# Altium schematic sheet MCU_CONTROL.SchDoc: MCU CONTROL
size 420 x 297 mm; DocumentNumber: 3; SheetNumber: 3; SheetTotal: 8
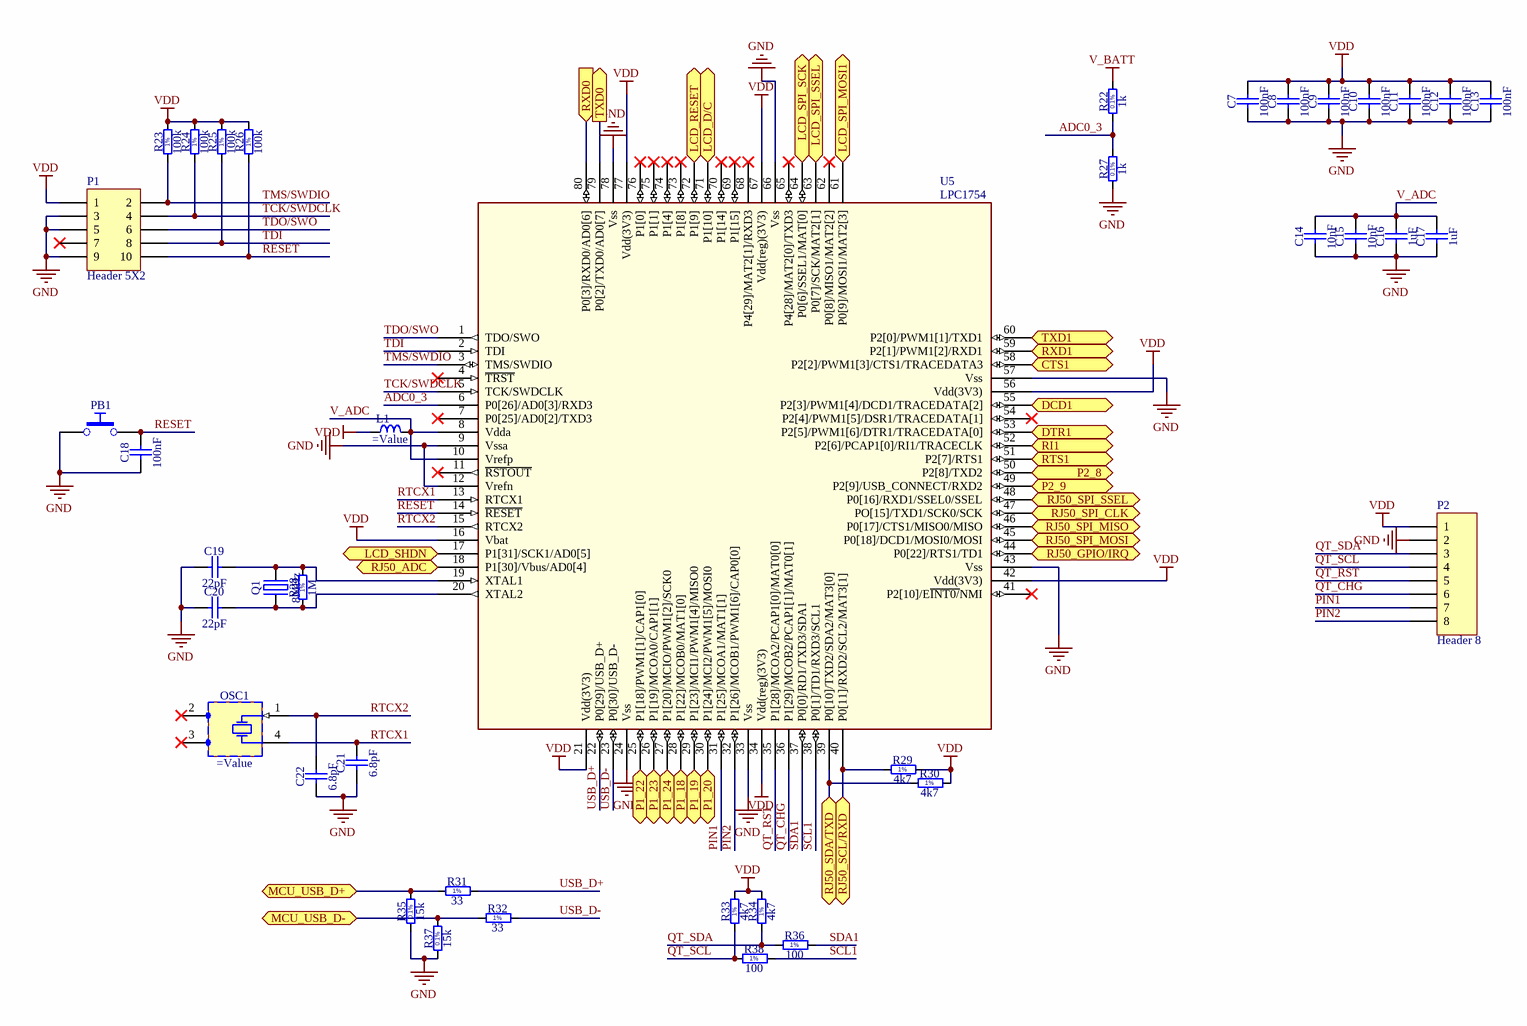
[diagram p0: MCU_CONTROL.SchDoc]

## Parts
C7  100nF  [CAPC1608X87N]
C8  100nF  [CAPC1608X87N]
C9  100nF  [CAPC1608X87N]
C10  100nF  [CAPC1608X87N]
C11  100nF  [CAPC1608X87N]
C12  100nF  [CAPC1608X87N]
C13  100nF  [CAPC1608X87N]
C14  10nF  [CAPC1608X87N]
C15  10nF  [CAPC1608X87N]
C16  1uF  [CAPC1608X87N]
C17  1uF  [CAPC1608X87N]
C18  100nF  [CAPC1608X87N]
C19  22pF  [CAPC1608X87N]
C20  22pF  [CAPC1608X87N]
C21  6.8pF  [CAPC1608X87N]
C22  6.8pF  [CAPC1608X87N]
L1  (no value)  [INDC1608X95N]
OSC1  (no value)  [85SMX CRYSTALS]
P1  Header 5X2  [HDR2X5]
P2  Header 8  [Pin_Head 2x4]
PB1  (no value)  [PB_TYCO_ALCOSWITCH_FSMSM]
Q1  8MHz  [XTAL_SMD]
R22  1k  [RESC1608X55N]
R23  100k  [RESC1608X55N]
R24  100k  [RESC1608X55N]
R25  100k  [RESC1608X55N]
R26  100k  [RESC1608X55N]
R27  1k  [RESC1608X55N]
R28  1M  [RESC1608X55N]
R29  4k7  [RESC1608X55N]
R30  4k7  [RESC1608X55N]
R31  33  [RESC1608X55N]
R32  33  [RESC1608X55N]
R33  4k7  [RESC1608X55N]
R34  4k7  [RESC1608X55N]
R35  15k  [RESC1608X55N]
R36  100  [RESC1608X55N]
R37  15k  [RESC1608X55N]
R38  100  [RESC1608X55N]
U5  LPC1754  [LQFP80]

## Ports
CTS1 (in), DCD1 (in), DTR1 (out), LCD_D/C (out), LCD_RESET (out), LCD_SHDN (out), LCD_SPI_MOSI1 (out), LCD_SPI_SCK (out), LCD_SPI_SSEL (out), MCU_USB_D+ (bidir), MCU_USB_D- (bidir), P1_18 (in), P1_19 (out), P1_20 (out), P1_22 (out), P1_23 (out), P1_24 (out), P2_8 (out), P2_9 (in), RI1 (in), RJ50_ADC (in), RJ50_GPIO/IRQ (bidir), RJ50_SCL/RXD (bidir), RJ50_SDA/TXD (bidir), RJ50_SPI_CLK (bidir), RJ50_SPI_MISO (bidir), RJ50_SPI_MOSI (bidir), RJ50_SPI_SSEL (bidir), RTS1 (out), RXD0 (in), RXD1 (in), TXD0 (out), TXD1 (out)

## Nets
GND: C7.1 C8.1 C9.1 C10.1 C11.1 C12.1 C13.1 C14.1 C15.1 C16.1 C17.1 C18.1 C19.1 C20.1 C21.1 C22.1 P1.3 P1.5 P1.9 P2.2 PB1.1 R27.1 R35.1 R37.1 U5.9(Vssa) U5.12(Vrefn) U5.24(Vss) U5.33(Vss) U5.43(Vss) U5.57(Vss) U5.66(Vss) U5.78(Vss)
V_BATT: R22.2
VDD: C7.2 C8.2 C9.2 C10.2 C11.2 C12.2 C13.2 L1.1 P1.1 P2.1 R23.2 R24.2 R25.2 R26.2 R29.2 R30.2 R33.2 R34.2 U5.16(Vbat) U5.21(Vdd(3V3)) U5.34(Vdd(reg)(3V3)) U5.42(Vdd(3V3)) U5.56(Vdd(3V3)) U5.67(Vdd(reg)(3V3)) U5.77(Vdd(3V3))
ADC0_3: R22.1 R27.2 U5.6(P0[26]/AD0[3]/RXD3)
CTS1: U5.58(P2[2]/PWM1[3]/CTS1/TRACEDATA3) ; port CTS1
DCD1: U5.55(P2[3]/PWM1[4]/DCD1/TRACEDATA[2]) ; port DCD1
DTR1: U5.53(P2[5]/PWM1[6]/DTR1/TRACEDATA[0]) ; port DTR1
LCD_D/C: U5.71(P1[10]) ; port LCD_D/C
LCD_RESET: U5.72(P1[9]) ; port LCD_RESET
LCD_SHDN: U5.17(P1[31]/SCK1/AD0[5]) ; port LCD_SHDN
LCD_SPI_MOSI1: U5.61(P0[9]/MOSI1/MAT2[3]) ; port LCD_SPI_MOSI1
LCD_SPI_SCK: U5.64(P0[6]/SSEL1/MAT[0]) ; port LCD_SPI_SCK
LCD_SPI_SSEL: U5.63(P0[7]/SCK/MAT2[1]) ; port LCD_SPI_SSEL
MCU_USB_D+: R31.1 R35.2 ; port MCU_USB_D+
MCU_USB_D-: R32.1 R37.2 ; port MCU_USB_D-
P1_18: U5.28(P1[22]/MCOB0/MAT1[0]) ; port P1_18
P1_19: U5.29(P1[23]/MCI1/PWM1[4]/MISO0) ; port P1_19
P1_20: U5.30(P1[24]/MCI2/PWM1[5]/MOSI0) ; port P1_20
P1_22: U5.25(P1[18]/PWM1[1]/CAP1[0]) ; port P1_22
P1_23: U5.26(P1[19]/MCOA0/CAP1[1]) ; port P1_23
P1_24: U5.27(P1[20]/MCIO/PWM1[2]/SCK0) ; port P1_24
P2_8: U5.50(P2[8]/TXD2) ; port P2_8
P2_9: U5.49(P2[9]/USB_CONNECT/RXD2) ; port P2_9
PIN1: P2.7 U5.31(P1[25]/MCOA1/MAT1[1])
PIN2: P2.8 U5.32(P1[26]/MCOB1/PWM1[6]/CAP0[0])
QT_CHG: P2.6 U5.36(P1[29]/MCOB2/PCAP1[1]/MAT0[1])
QT_RST: P2.5 U5.35(P1[28]/MCOA2/PCAP1[0]/MAT0[0])
QT_SCL: P2.4 R33.1 R38.1
QT_SDA: P2.3 R34.1 R36.1
RESET: C18.2 P1.10 PB1.2 R26.1 U5.14(~{RESET})
RI1: U5.52(P2[6]/PCAP1[0]/RI1/TRACECLK) ; port RI1
RJ50_ADC: U5.18(P1[30]/Vbus/AD0[4]) ; port RJ50_ADC
RJ50_GPIO/IRQ: U5.44(P0[22]/RTS1/TD1) ; port RJ50_GPIO/IRQ
RJ50_SCL/RXD: R29.1 U5.40(P0[11]/RXD2/SCL2/MAT3[1]) ; port RJ50_SCL/RXD
RJ50_SDA/TXD: R30.1 U5.39(P0[10]/TXD2/SDA2/MAT3[0]) ; port RJ50_SDA/TXD
RJ50_SPI_CLK: U5.47(PO[15]/TXD1/SCK0/SCK) ; port RJ50_SPI_CLK
RJ50_SPI_MISO: U5.46(P0[17]/CTS1/MISO0/MISO) ; port RJ50_SPI_MISO
RJ50_SPI_MOSI: U5.45(P0[18]/DCD1/MOSI0/MOSI) ; port RJ50_SPI_MOSI
RJ50_SPI_SSEL: U5.48(P0[16]/RXD1/SSEL0/SSEL) ; port RJ50_SPI_SSEL
RTCX1: C21.2 OSC1.4(X) U5.13(RTCX1)
RTCX2: C22.2 OSC1.1(X) U5.15(RTCX2)
RTS1: U5.51(P2[7]/RTS1) ; port RTS1
RXD0: U5.80(P0[3]/RXD0/AD0[6]) ; port RXD0
RXD1: U5.59(P2[1]/PWM1[2]/RXD1) ; port RXD1
SCL1: R38.2 U5.38(P0[1]/TD1/RXD3/SCL1)
SDA1: R36.2 U5.37(P0[0]/RD1/TXD3/SDA1)
TCK/SWDCLK: P1.4 R24.1 U5.5(TCK/SWDCLK)
TDI: P1.8 R25.1 U5.2(TDI)
TDO/SWO: P1.6 U5.1(TDO/SWO)
TMS/SWDIO: P1.2 R23.1 U5.3(TMS/SWDIO)
TXD0: U5.79(P0[2]/TXD0/AD0[7]) ; port TXD0
TXD1: U5.60(P2[0]/PWM1[1]/TXD1) ; port TXD1
USB_D+: R31.2 U5.22(P0[29]/USB_D+)
USB_D-: R32.2 U5.23(P0[30]/USB_D-)
V_ADC: C14.2 C15.2 C16.2 C17.2 L1.2 U5.8(Vdda) U5.10(Vrefp)
NetC19_2: C19.2 Q1.2(OSC2) R28.2 U5.19(XTAL1)
NetC20_2: C20.2 Q1.1(OSC1) R28.1 U5.20(XTAL2)

Not connected (* = marked no-connect by the designer): OSC1 2(GND)* 3(GND)*; P1 7*; U5 4(~{TRST})* 7(P0[25]/AD0[2]/TXD3)* 11(~{RSTOUT})* 41(P2[10]/E~{INT0}~{/}NMI)* 54(P2[4]/PWM1[5]/DSR1/TRACEDATA[1])* 62(P0[8]/MISO1/MAT2[2])* 65(P4[28]/MAT2[0]/TXD3)* 68(P4[29]/MAT2[1]/RXD3)* 69(P1[15])* 70(P1[14])* 73(P1[8])* 74(P1[4])* 75(P1[1])* 76(P1[0])*

## Notes on the sheet
- Project/Equipment
- Document
- Sensorbox
- Designer
- Drawn by
- Check.by
- Copyright Creotech Instruments SA 2014.
  This documentation describes Open Hardware and is licensed under the CERN OHL v.1.1. You may redistribute and modify this documentation under the terms of the CERN OHL v.1.1. (http://ohwr.org/CERNOHL). This documentation is distributed WITHOUT ANY EXPRESS OR IMPLIED WARRANTY, INCLUDING OF MERCHANTABILITY, SATISFACTORY QUALITY AND FITNESS FOR A PARTICULAR PURPOSE. Please see the CERN OHL v.1.1 for applicable conditions.
- CTI
- Creotech Instruments S.A.
- File
- Last Mod.
- Print Date
- Sheet
- Size
- A3
- of
- Rev
- (in symbol R0603_1K0_0.1%_0.063W_10PPM) 0.1%
- (in symbol R0603_1M_1%_0.1W_100PPM) 1%
- (in symbol R0603_4K7_1%_0.1W_100PPM) 1%
- (in symbol R0603_15K_0.1%_0.063W_10PPM) 0.1%
- (in symbol R0603_33R_1%_0.1W_100PPM) 1%
- (in symbol R0603_100K_1%_0.1W_100PPM) 1%
- (in symbol R0603_100R_1%_0.1W_100PPM) 1%

## Library data of the parts
C7-C13 C18 = CC0603_100NF_50V_10%_X7R: Non-polarised capacitor; Part Description: SMD Multilayer Chip Ceramic Capacitor; Manufacturer: GENERIC; Manufacturer1 Part Number: 223858615649; Voltage: 50V; TC: X7R; Tolerance: ±10%; Table: Capacitors SMD; Part Number: CC0603_100NF_50V_10%_X7R; Component Kind: Standard; Component Type: Standard; Pin Count: 2; Value: 100nF; Status: Preferred; Manufacturer Part Number: CC0603_100NF_50V_10%_X7R; Case: 0603; Mounted: Yes; Socket: No; SMD: Yes; Manufacturer1 Example: PHYCOMP; Manufacturer1 ComponentHeight: 0.87mm; HelpURL: \\cern.ch\dfs\Applications\Altium\Datasheets\CC0603_X7R_PHYCOMP.pdf; Author: CERN DEM JLC; CreateDate: 2007-12-03; LatestRevisionDate: 2007-12-03
C14 C15 = CC0603_10NF_50V_10%_X7R: Non-polarised capacitor; Part Description: SMD Multilayer Chip Ceramic Capacitor; Manufacturer: GENERIC; Manufacturer1 Part Number: 223858615636; Voltage: 50V; TC: X7R; Tolerance: ±10%; Table: Capacitors SMD; Part Number: CC0603_10NF_50V_10%_X7R; Component Kind: Standard; Component Type: Standard; Pin Count: 2; Value: 10nF; Status: Preferred; Manufacturer Part Number: CC0603_10NF_50V_10%_X7R; Case: 0603; Mounted: Yes; Socket: No; SMD: Yes; Manufacturer1 Example: PHYCOMP; Manufacturer1 ComponentHeight: 0.87mm; HelpURL: \\cern.ch\dfs\Applications\Altium\Datasheets\CC0603_X7R_PHYCOMP.pdf; Author: CERN DEM JLC; CreateDate: 2007-12-03; LatestRevisionDate: 2007-12-03
C16 C17 = CC0603_1UF_16V_10%_X7R: Non-polarised capacitor; Part Description: SMD Multilayer Chip Ceramic Capacitor; Manufacturer: GENERIC; Manufacturer1 Part Number: 223824613663; Voltage: 16V; TC: X7R; Tolerance: ±10%; Table: Capacitors SMD; Part Number: CC0603_1UF_16V_10%_X7R; Component Kind: Standard; Component Type: Standard; Pin Count: 2; Value: 1uF; Status: Preferred; Manufacturer Part Number: CC0603_1uF_16V_10%_X7R; Case: 0603; Mounted: Yes; Socket: No; SMD: Yes; Manufacturer1 Example: PHYCOMP; Manufacturer1 ComponentHeight: 0.87mm; HelpURL: \\cern.ch\dfs\Applications\Altium\Datasheets\CC0805_X5R_PHYCOMP_HC.pdf; Author: CERN DEM JLC; CreateDate: 2007-12-03; LatestRevisionDate: 2007-12-03
C19 C20 = CC0603_22PF_50V_5%_NP0: Non-polarised capacitor; Part Description: SMD Multilayer Chip Ceramic Capacitor; Manufacturer: GENERIC; Manufacturer1 Part Number: 223886715229; Voltage: 50V; TC: NP0; Tolerance: ±5%; Table: Capacitors SMD; Part Number: CC0603_22PF_50V_5%_NP0; Component Kind: Standard; Component Type: Standard; Pin Count: 2; Value: 22pF; Status: Preferred; Manufacturer Part Number: CC0603_22PF_50V_5%_NP0; Case: 0603; Mounted: Yes; Socket: No; SMD: Yes; Manufacturer1 Example: PHYCOMP; Manufacturer1 ComponentHeight: 0.87mm; HelpURL: \\cern.ch\dfs\Applications\Altium\Datasheets\CC0603_NP0_PHYCOMP.pdf; Author: CERN DEM JLC; CreateDate: 2007-12-03; LatestRevisionDate: 2007-12-03
C21 C22 = CC0603_6.8PF_50V_0.5PF_NP0: Non-polarised capacitor; Part Description: SMD Multilayer Chip Ceramic Capacitor; Manufacturer: GENERIC; Manufacturer1 Part Number: 223886715688; Voltage: 50V; TC: NP0; Tolerance: ±0.5pF; Table: Capacitors SMD; Part Number: CC0603_6.8PF_50V_0.5PF_NP0; Component Kind: Standard; Component Type: Standard; Pin Count: 2; Value: 6.8pF; Status: Preferred; Manufacturer Part Number: CC0603_6.8PF_50V_0.5PF_NP0; Case: 0603; Mounted: Yes; Socket: No; SMD: Yes; Manufacturer1 Example: PHYCOMP; Manufacturer1 ComponentHeight: 0.87mm; HelpURL: \\cern.ch\dfs\Applications\Altium\Datasheets\CC0603_NP0_PHYCOMP.pdf; Author: CERN DEM JLC; CreateDate: 2007-12-03; LatestRevisionDate: 2007-12-03
L1 = Inductor
OSC1 = Quartz Crystal 1X 2CASE 3CASE 4X: Crystal 4 pins 1=XTAL Control 2=CASE 3=CASE 4=XTAL
P1 = Header 5X2: Header, 5-Pin, Dual row; LatestRevisionDate: 17-Jul-2002; LatestRevisionNote: Re-released for DXP Platform.; Publisher: Altium Limited
P2 = Header 8: Header, 8-Pin; LatestRevisionDate: 17-Jul-2002; LatestRevisionNote: Re-released for DXP Platform.; Publisher: Altium Limited
PB1 = PB SPST 1NO-2NO: Push-Button Switch SPDT
Q1 = Quartz Crystal
R22 R27 = R0603_1K0_0.1%_0.063W_10PPM: Resistor - 0.1%; Part Description: Thin Film Chip Resistor; Manufacturer: GENERIC; Manufacturer1 Part Number: RN73C1J1K0BTDF; Power: 0.063W; TC: ±10ppm; Table: Resistors SMD; Part Number: R0603_1K0_0.1%_0.063W_10PPM; Component Kind: Standard; Component Type: Standard; Pin Count: 2; Value: 1k; Status: Not recommended; Tolerance: ±0.1%; Manufacturer Part Number: R0603_1K0_0.1%_0.063W_10PPM; Case: 0603; Mounted: Yes; Socket: No; SMD: Yes; Manufacturer1 Example: TYCO HOLSWORTHY; Manufacturer1 ComponentHeight: 0.5mm; HelpURL: \\cern.ch\dfs\Applications\Altium\Datasheets\R0603_Tyco_RN73.pdf; Author: CERN DEM JLC; CreateDate: 2007-12-03; LatestRevisionDate: 2008-03-13
R23-R26 = R0603_100K_1%_0.1W_100PPM: Resistor - 1%; Part Description: General Purpose Thick Film Chip Resistor; Manufacturer: GENERIC; Manufacturer1 Part Number: NRC06F1003TRF; Power: 0.1W; TC: ±100ppm/°C; Table: Resistors SMD; Part Number: R0603_100K_1%_0.1W_100PPM; Component Kind: Standard; Component Type: Standard; Pin Count: 2; Value: 100k; Status: Preferred; Tolerance: ±1%; Manufacturer Part Number: R0603_100K_1%_0.1W_100PPM; Case: 0603; Mounted: Yes; Socket: No; SMD: Yes; Manufacturer1 Example: NIC COMPONENT; Manufacturer1 ComponentHeight: 0.55mm; HelpURL: \\cern.ch\dfs\Applications\Altium\Datasheets\R0603_NIC_NRC.pdf; Author: CERN DEM JLC; CreateDate: 2007-12-03; LatestRevisionDate: 2008-03-13
R28 = R0603_1M_1%_0.1W_100PPM: Resistor - 1%; Part Description: General Purpose Thick Film Chip Resistor; Manufacturer: GENERIC; Manufacturer1 Part Number: NRC06F1004TRF; Power: 0.1W; TC: ±100ppm/°C; Table: Resistors SMD; Part Number: R0603_1M_1%_0.1W_100PPM; Component Kind: Standard; Component Type: Standard; Pin Count: 2; Value: 1M; Status: Preferred; Tolerance: ±1%; Manufacturer Part Number: R0603_1M_1%_0.1W_100PPM; Case: 0603; Mounted: Yes; Socket: No; SMD: Yes; Manufacturer1 Example: NIC COMPONENT; Manufacturer1 ComponentHeight: 0.55mm; HelpURL: \\cern.ch\dfs\Applications\Altium\Datasheets\R0603_NIC_NRC.pdf; Author: CERN DEM JLC; CreateDate: 2007-12-03; LatestRevisionDate: 2008-03-13
R29 R30 R33 R34 = R0603_4K7_1%_0.1W_100PPM: Resistor - 1%; Part Description: General Purpose Thick Film Chip Resistor; Manufacturer: GENERIC; Manufacturer1 Part Number: NRC06F4701TRF; Power: 0.1W; TC: ±100ppm/°C; Table: Resistors SMD; Part Number: R0603_4K7_1%_0.1W_100PPM; Component Kind: Standard; Component Type: Standard; Pin Count: 2; Value: 4k7; Status: Preferred; Tolerance: ±1%; Manufacturer Part Number: R0603_4K7_1%_0.1W_100PPM; Case: 0603; Mounted: Yes; Socket: No; SMD: Yes; Manufacturer1 Example: NIC COMPONENT; Manufacturer1 ComponentHeight: 0.55mm; HelpURL: \\cern.ch\dfs\Applications\Altium\Datasheets\R0603_NIC_NRC.pdf; Author: CERN DEM JLC; CreateDate: 2007-12-03; LatestRevisionDate: 2008-03-13
R31 R32 = R0603_33R_1%_0.1W_100PPM: Resistor - 1%; Part Description: General Purpose Thick Film Chip Resistor; Manufacturer: GENERIC; Manufacturer1 Part Number: NRC06F33R0TRF; Power: 0.1W; TC: ±100ppm/°C; Table: Resistors SMD; Part Number: R0603_33R_1%_0.1W_100PPM; Component Kind: Standard; Component Type: Standard; Pin Count: 2; Value: 33; Status: Preferred; Tolerance: ±1%; Manufacturer Part Number: R0603_33R_1%_0.1W_100PPM; Case: 0603; Mounted: Yes; Socket: No; SMD: Yes; Manufacturer1 Example: NIC COMPONENT; Manufacturer1 ComponentHeight: 0.55mm; HelpURL: \\cern.ch\dfs\Applications\Altium\Datasheets\R0603_NIC_NRC.pdf; Author: CERN DEM JLC; CreateDate: 2007-12-03; LatestRevisionDate: 2008-03-13
R35 R37 = R0603_15K_0.1%_0.063W_10PPM: Resistor - 0.1%; Part Description: Thin Film Chip Resistor; Manufacturer: GENERIC; Manufacturer1 Part Number: RN73C1J15KBTDF; Power: 0.063W; TC: ±10ppm; Table: Resistors SMD; Part Number: R0603_15K_0.1%_0.063W_10PPM; Component Kind: Standard; Component Type: Standard; Pin Count: 2; Value: 15k; Status: Not recommended; Tolerance: ±0.1%; Manufacturer Part Number: R0603_15K_0.1%_0.063W_10PPM; Case: 0603; Mounted: Yes; Socket: No; SMD: Yes; Manufacturer1 Example: TYCO HOLSWORTHY; Manufacturer1 ComponentHeight: 0.5mm; HelpURL: \\cern.ch\dfs\Applications\Altium\Datasheets\R0603_Tyco_RN73.pdf; Author: CERN DEM JLC; CreateDate: 2007-12-03; LatestRevisionDate: 2008-03-13
R36 R38 = R0603_100R_1%_0.1W_100PPM: Resistor - 1%; Part Description: General Purpose Thick Film Chip Resistor; Manufacturer: GENERIC; Manufacturer1 Part Number: NRC06F4700TRF; Power: 0.1W; TC: ±100ppm/°C; Table: Resistors SMD; Part Number: R0603_100R_1%_0.1W_100PPM; Component Kind: Standard; Component Type: Standard; Pin Count: 2; Value: 100; Status: Preferred; Tolerance: ±1%; Manufacturer Part Number: R0603_100R_1%_0.1W_100PPM; Case: 0603; Mounted: Yes; Socket: No; SMD: Yes; Manufacturer1 Example: NIC COMPONENT; Manufacturer1 ComponentHeight: 0.55mm; HelpURL: \\cern.ch\dfs\Applications\Altium\Datasheets\R0603_NIC_NRC.pdf; Author: CERN DEM JLC; CreateDate: 2007-12-03; LatestRevisionDate: 2008-03-13